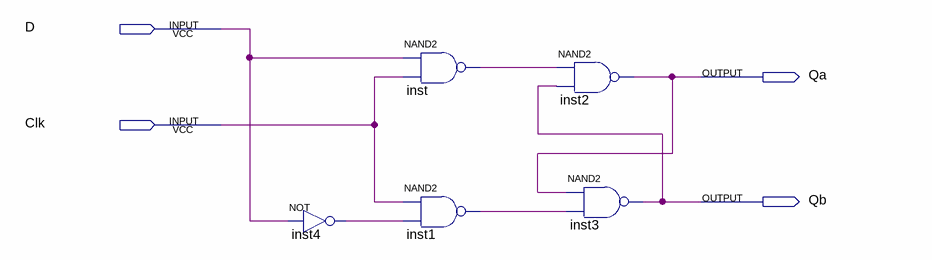
[diagram p0: schematic sheet]
// Quartus schematic part2_bloco.bdf as structural Verilog: 5 symbols, 4 pins
module part2_bloco (
  input  D,
  input  Clk,
  output Qa,
  output Qb
);

  wire inst1_out, inst4_out, inst_out;

  not inst4 (inst4_out, D);
  nand inst (inst_out, D, Clk);
  nand inst1 (inst1_out, Clk, inst4_out);
  nand inst2 (Qa, inst_out, Qb);
  nand inst3 (Qb, Qa, inst1_out);
endmodule
